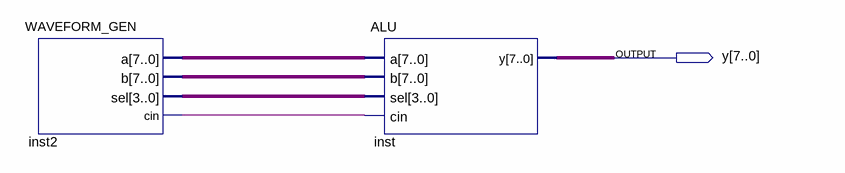
[diagram p0: schematic sheet]
// Quartus schematic tb_top.bdf as structural Verilog: 2 symbols, 1 pins
module tb_top (
  output [7:0] y
);

  wire inst2_cin;
  wire [3:0] inst2_sel;
  wire [7:0] inst2_a, inst2_b;

  WAVEFORM_GEN inst2 (.a(inst2_a), .b(inst2_b), .sel(inst2_sel), .cin(inst2_cin));
  ALU inst (.a(inst2_a), .b(inst2_b), .sel(inst2_sel), .cin(inst2_cin), .y(y));
endmodule
